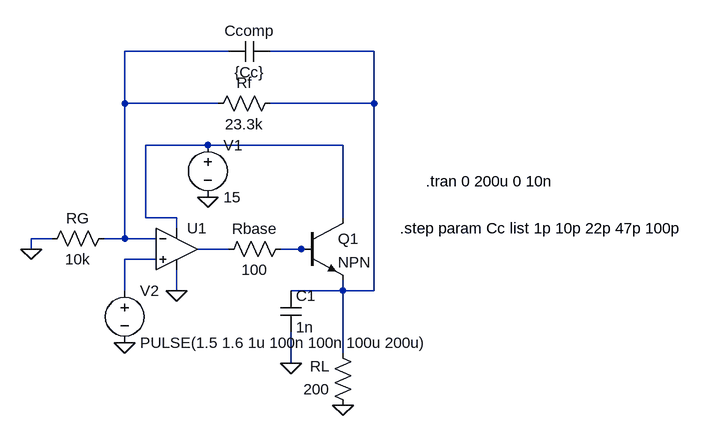
[diagram p0: schematic 01_sweep_source_compensation.asc]
01_sweep_source_compensation.asc, the LTspice schematic file:
Version 4.1
SHEET 1 1072 680
WIRE 336 -112 176 -112
WIRE 560 -112 400 -112
WIRE 176 -32 176 -112
WIRE 320 -32 176 -32
WIRE 560 -32 560 -112
WIRE 560 -32 400 -32
WIRE 304 32 208 32
WIRE 512 32 304 32
WIRE 208 144 208 32
WIRE 256 144 208 144
WIRE 512 144 512 32
WIRE 256 160 256 144
WIRE 64 176 32 176
WIRE 176 176 176 -32
WIRE 176 176 144 176
WIRE 224 176 176 176
WIRE 32 192 32 176
WIRE 336 192 288 192
WIRE 448 192 416 192
WIRE 464 192 448 192
WIRE 224 208 176 208
WIRE 176 256 176 208
WIRE 256 256 256 224
WIRE 512 256 512 240
WIRE 512 256 432 256
WIRE 560 256 560 -32
WIRE 560 256 512 256
WIRE 512 352 512 256
WIRE 432 368 432 320
FLAG 176 336 0
FLAG 32 192 0
FLAG 512 432 0
FLAG 256 256 0
FLAG 304 112 0
FLAG 432 368 0
SYMBOL OpAmps\\UniversalOpAmp2 256 192 R0
SYMATTR InstName U1
SYMBOL voltage 176 240 R0
WINDOW 123 0 0 Left 0
WINDOW 39 0 0 Left 0
SYMATTR InstName V2
SYMATTR Value PULSE(1.5 1.6 1u 100n 100n 100u 200u)
SYMBOL res 160 160 R90
WINDOW 0 0 56 VBottom 2
WINDOW 3 32 56 VTop 2
SYMATTR InstName RG
SYMATTR Value 10k
SYMBOL npn 448 144 R0
SYMATTR InstName Q1
SYMBOL res 416 -48 R90
WINDOW 0 0 56 VBottom 2
WINDOW 3 32 56 VTop 2
SYMATTR InstName Rf
SYMATTR Value 23.3k
SYMBOL res 528 448 R180
WINDOW 0 36 76 Left 2
WINDOW 3 36 40 Left 2
SYMATTR InstName RL
SYMATTR Value 200
SYMBOL voltage 304 16 R0
SYMATTR InstName V1
SYMATTR Value 15
SYMBOL res 432 176 R90
WINDOW 0 0 56 VBottom 2
WINDOW 3 32 56 VTop 2
SYMATTR InstName Rbase
SYMATTR Value 100
SYMBOL cap 400 -128 R90
WINDOW 0 0 32 VBottom 2
WINDOW 3 32 32 VTop 2
SYMATTR InstName Ccomp
SYMATTR Value {Cc}
SYMBOL cap 416 256 R0
SYMATTR InstName C1
SYMATTR Value 1n
TEXT 640 88 Left 2 !.tran 0 200u 0 10n
TEXT 600 160 Left 2 !.step param Cc list 1p 10p 22p 47p 100p

The netlist it stands for:
* 01_sweep_source_compensation.asc
X§U1 N006 N001 N003 0 N004 level2 Avol=1Meg GBW=10Meg Slew=10Meg Ilimit=25m Rail=0 Vos=0 En=0 Enk=0 In=0 Ink=0 Rin=500Meg  ; pins In+ In- V+ V- OUT
V2 N006 0 PULSE(1.5 1.6 1u 100n 100n 100u 200u)
RG N001 0 10k
Q1 N003 N005 N002 0 NPN
Rf N002 N001 23.3k
RL 0 N002 200
V1 N003 0 15
Rbase N005 N004 100
Ccomp N002 N001 {Cc}
C1 N002 0 1n
.model NPN NPN
.model PNP PNP
.lib standard.bjt
.tran 0 200u 0 10n
.step param Cc list 1p 10p 22p 47p 100p
.lib UniversalOpAmp2.lib
.backanno
.end